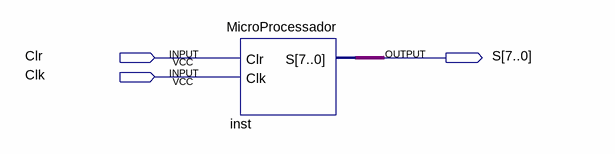
[diagram p0: schematic sheet]
// Quartus schematic Teste.bdf as structural Verilog: 1 symbols, 3 pins
module Teste (
  input  Clr,
  input  Clk,
  output [7:0] S
);

  MicroProcessador inst (.Clr(Clr), .Clk(Clk), .S(S));
endmodule
